# Altium project SDP21_Main_Board_REV1.PrjPcb
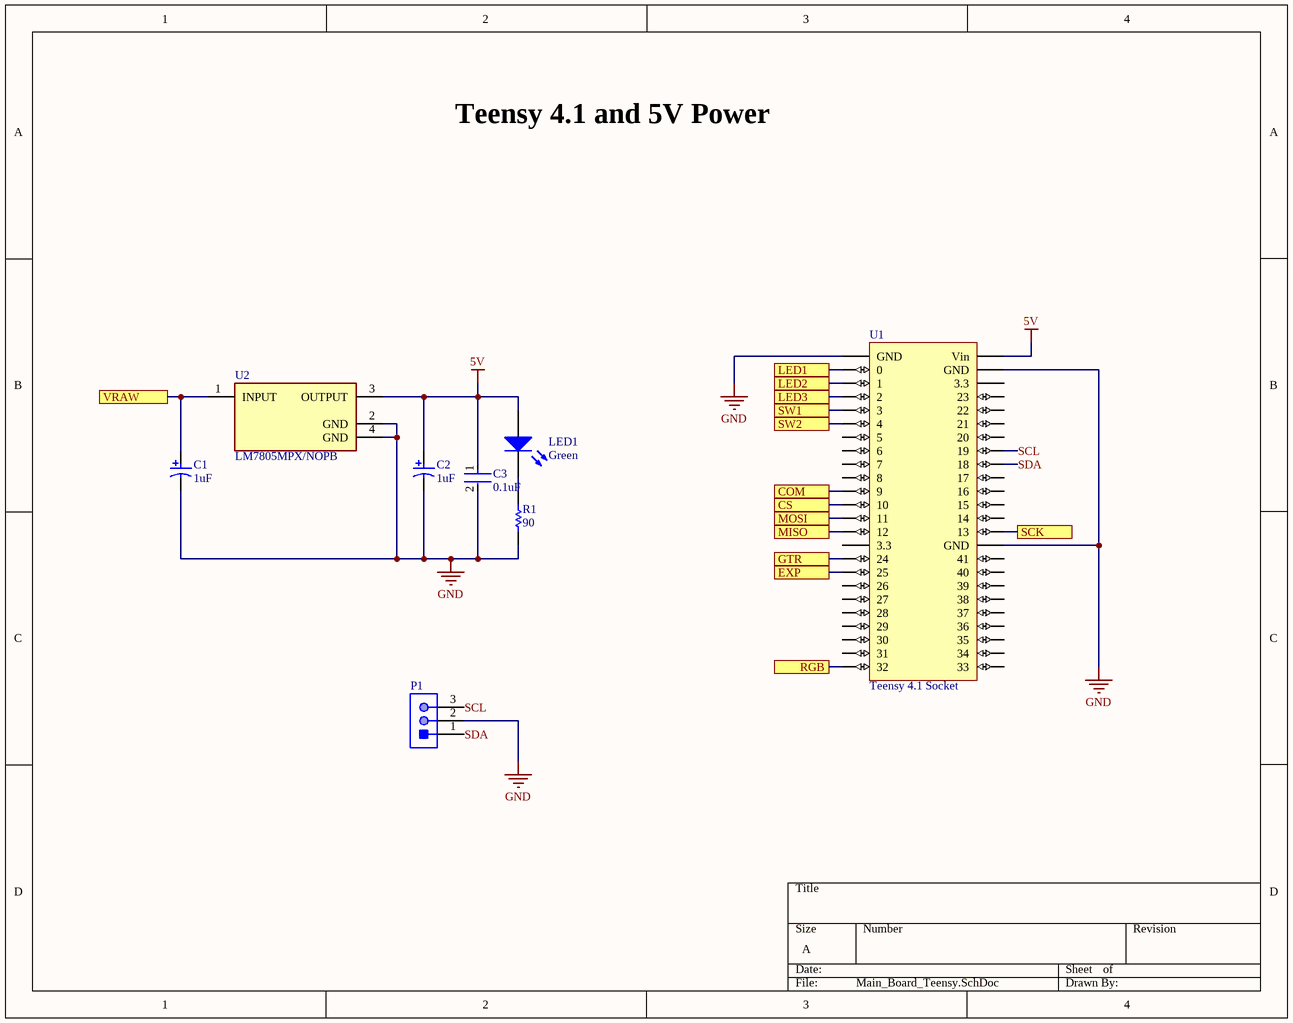
[diagram p0: Main_Board_Teensy.SchDoc]
4 sheets, 65 parts. Net scope: flat (ports and power ports of the same name join across sheets).
Board file: Main_Board_PCB.PcbDoc
Sheets:
  Main_Board_Teensy.SchDoc
  Main_Board_IO.SchDoc
  Main_Board_ESP32.SchDoc
  Main_Board_Guitar_Buffer.SchDoc

## Sheet Main_Board_Teensy.SchDoc
size A; SheetNumber: 1; SheetTotal: 4

### Parts
C1  1uF  [KEMT-T491-C_L]
C2  1uF  [KEMT-T491-C_L]
C3  0.1uF  [FP-GCM188-0_1-IPC_B]
LED1  Green  [0603_A]
P1  B3B-PH-K-S(LF)(SN)  [JST-B3B-PH-K-S-3_V]  (value not drawn)
R1  90  [RESC2013X50X40LL20T20]
U1  Teensy 4.1 Socket  [Teensy 4.1 Socket]
U2  LM7805MPX/NOPB  [FP-LM7805MPX-NOPB-MFG]

### Ports
COM, CS, EXP, GTR, LED1, LED2, LED3, MISO, MOSI, RGB, SCK, SW1, SW2, VRAW

### Nets
5V: C2.1 C3.1 LED1.2(A) U1.Vin U2.3(OUTPUT)
GND: C1.2 C2.2 C3.2 P1.2 R1.1 U1.GND1(GND) U1.GND2(GND) U1.GND3(GND) U2.2(GND) U2.4(GND)
SCL: P1.3 U1.19
SDA: P1.1 U1.18
NetC1_1: C1.1 U2.1(INPUT) ; port VRAW
NetC13_2: U1.24 ; port GTR
NetDS1_1: U1.0 ; port LED1
NetDS2_1: U1.1 ; port LED2
NetDS3_1: U1.2 ; port LED3
NetEXP1_2: U1.25 ; port EXP
NetLED1_1: LED1.1(K) R1.2
NetR7_1: U1.4 ; port SW2
NetR8_1: U1.3 ; port SW1
NetU1_9: U1.9 ; port COM
NetU1_10: U1.10 ; port CS
NetU1_11: U1.11 ; port MOSI
NetU1_12: U1.12 ; port MISO
NetU1_13: U1.13 ; port SCK
NetU1_32: U1.32 ; port RGB

Not connected (* = marked no-connect by the designer): U1 3.3-1(3.3) 3.3-2(3.3) 5 6 7 8 14 15 16 17 20 21 22 23 26 27 28 29 30 31 33 34 35 36 37 38 39 40 41

### Notes on the sheet
- Teensy 4.1 and 5V Power

### Library data of the parts
C1 C2 = CMP-2000-07195-1: Tantalum Capacitor, 1 uF, +/- 10%, 50 V, -55 to 125 degC, 2-Pin SMD, RoHS, Tape and Reel; Manufacturer: Kemet; Capacitance: 1000000pF; Rad Hardened: No; Case Style: Molded; Product Diameter (mm): NotRequiredmm; Seal: NotRequired; DF: 4%; ESR: 5.5ohm; DCL: 0.5uA; Product Length (mm): 6mm; Product Height (mm): 2.5mm; Polarity: Polar; Voltage: 50VDC; Product Depth (mm): 3.2mm; Operating Temp Range: -55Cto125C; Package Description: 2-Pin Surface Mount Device, Body 6 x 3.2 mm; Failure Rate: NotRequired; Seated Plane Height: NotRequiredmm; Lead Spacing (nom): NotRequiredmm; Packaging: TapeandReel; Case Code: C; Length W/Weld: NotRequiredmm; Tolerance (+ or -): 10%; Datasheet URL: http://capacitoredge.kemet.com/capedge2/DataSheet/Datasheet-T491C105K050AT.pdf?pn=T491C105K050AT; Datasheet Version: 10/2016; Manufacturer URL: http://www.kemet.com/; Wire Form: NotRequired; Package / Case: 6032-28; Mounting Technology: SurfaceMount; Construction: SMTChip; Package Reference: T491-C; Length W/Weld (max): NotRequiredmm; Insulation: NotRequired; Mounting Style: SurfaceMount
C3 = CMP-2006-02353-3: Ceramic Capacitor for Automotive 100nF  ±10% 50VDC X8L 0603 Paper T/R; Voltage Rating: 50V; Height: 0.8mm; Lead Free: Lead Free; Case/Package: 0603; Dielectric: X8L; Packaging: Tape and Reel; Termination: SMD/SMT; Package Quantity: 4000; Width: 0.5mm; Max Operating Temperature: 150°C; Case Code (Metric): 1608; Thickness: 0.035inch; Capacitance: 100nF; Tolerance: 10%; Voltage Rating (DC): 50V; Ratings: AEC-Q200; Case Code (Imperial): 0603; Voltage: 50V; Depth: 0.8mm; Radiation Hardening: No; Length: 1.6mm; Mount: Surface Mount; Min Operating Temperature: -55°C
LED1 = CMP-1426-00002-1: SMD mono-color Chip LED, WL-SMCW, Green; PartNumber: 150060GS75000; Manufacturer: Wuerth Elektronik; ComponentLink1URL: http://www.we-online.com; ComponentLink2Description: Datasheet; Color: Green; ComponentLink2URL: http://katalog.we-online.com/led/datasheet/150060GS75000.pdf; PackageReference: 0603_A; ComponentLink1Description: Manufacturer URL
P1 = CMP-2000-05164-1: Male Header, Pitch 2 mm, 1 x 3 Position, Height 6 mm, Tail Length 3.4 mm, -25 to 85 degC, RoHS, Bulk; Manufacturer: JST; Style/Orientation: StraightHeader/Plug; Pitch: 2mm; No of Positions: 3; Termination: Crimp; Manufacturer URL: http://www.jst.com/home2.html; Datasheet Version: Oct-06; Type: ShroudedHeader; Datasheet URL: https://datasheet.ciiva.com/11746/0900766b80826550-11746939.pdf
R1 = CMP-2001-03378-1: Manufacturer: Susumu; Part Number: RR1220P-331-D
U1 = Teensy 4.1 Socket: Teensy 4.1
U2 = CMP-04917-000022-1: IC REG LINEAR 5V 1.5A SOT223-4; Manufacturer: Texas Instruments; Dropout Voltage: 2V; Output Type: Fixed; Accuracy Percentage: 3%; Nominal Supply Current: 8mA; Standoff Height: 0.02mm; Min Supply Voltage: 7.5V; Number Of Outputs: 1; Max Junction Temp: +150°C; Max Supply Voltage: 30V; Height: 1.8mm; Temperature Range High: +125°C; Device Class L3: Voltage Regulators - Linear; Lead Free: Yes; Digikey Description: IC REG LINEAR 5V 1.5A SOT223-4; Output Current: 1.5A; Manufacturer Part Number: LM7805MPX/NOPB; Automotive: No; Device Class L1: Integrated Circuits (ICs); ComponentLink2Description: Datasheet; Device Class L2: Power Management ICs; Category: IC; Octopart: https://octopart.com/lm7805mpx%2Fnopb-texas+instruments-74629992; Package: SOT223-4; RoHS: TRUE; Output Voltage: 5V; Temperature Range Low: 0°C; Temperature: 0°C to +125°C; ComponentLink2URL: http://www.ti.com/lit/ds/symlink/lm7800.pdf

## Sheet Main_Board_IO.SchDoc
size Letter; SheetNumber: 2; SheetTotal: 4
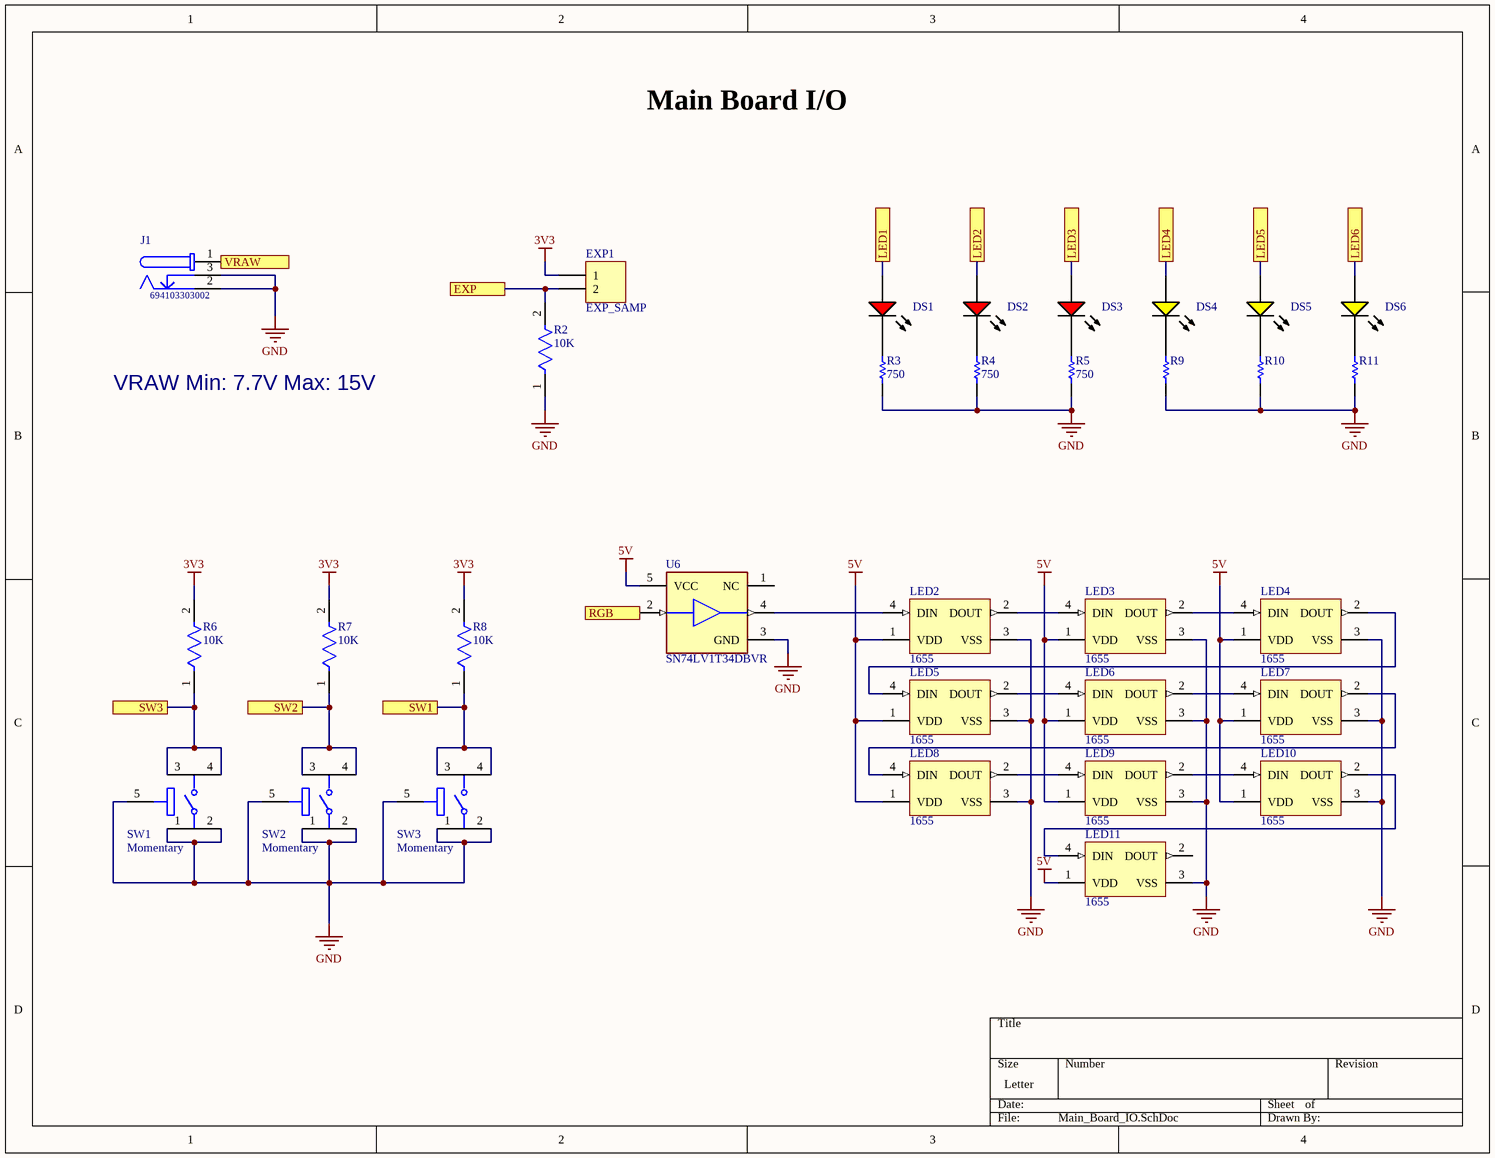
[diagram p1: Main_Board_IO.SchDoc]

### Parts
DS1  TLMS1000-GS08  [VISH-TLMS1000_V]  (value not drawn)
DS2  TLMS1000-GS08  [VISH-TLMS1000_V]  (value not drawn)
DS3  TLMS1000-GS08  [VISH-TLMS1000_V]  (value not drawn)
DS4  TLMY1000-GS08  [VISH-TLMY1000_V]  (value not drawn)
DS5  TLMY1000-GS08  [VISH-TLMY1000_V]  (value not drawn)
DS6  TLMY1000-GS08  [VISH-TLMY1000_V]  (value not drawn)
EXP1  EXP_SAMP  [HDR1X2]
J1  694103303002  [694103303002]
LED2  1655  [ADA-RGB-1655_V]
LED3  1655  [ADA-RGB-1655_V]
LED4  1655  [ADA-RGB-1655_V]
LED5  1655  [ADA-RGB-1655_V]
LED6  1655  [ADA-RGB-1655_V]
LED7  1655  [ADA-RGB-1655_V]
LED8  1655  [ADA-RGB-1655_V]
LED9  1655  [ADA-RGB-1655_V]
LED10  1655  [ADA-RGB-1655_V]
LED11  1655  [ADA-RGB-1655_V]
R2  10K  [FP-CR1206-IPC_B]
R3  750  [RESC2013X50X40LL20T20]
R4  750  [RESC2013X50X40LL20T20]
R5  750  [RESC2013X50X40LL20T20]
R6  10K  [FP-CR1206-IPC_B]
R7  10K  [FP-CR1206-IPC_B]
R8  10K  [FP-CR1206-IPC_B]
R9  RR1220P-331-D  [RESC2013X50X40LL20T20]  (value not drawn)
R10  RR1220P-331-D  [RESC2013X50X40LL20T20]  (value not drawn)
R11  RR1220P-331-D  [RESC2013X50X40LL20T20]  (value not drawn)
SW1  Momentary  [FP-B3SN-3112P-MFG]
SW2  Momentary  [FP-B3SN-3112P-MFG]
SW3  Momentary  [FP-B3SN-3112P-MFG]
U6  SN74LV1T34DBVR  [FP-DBV0005A-IPC_B]

### Ports
EXP, LED1, LED2, LED3, LED4, LED5, LED6, RGB, SW1, SW2, SW3, VRAW

### Nets
3V3: EXP1.1 R6.2 R7.2 R8.2
5V: LED2.1(VDD) LED3.1(VDD) LED4.1(VDD) LED5.1(VDD) LED6.1(VDD) LED7.1(VDD) LED8.1(VDD) LED9.1(VDD) LED10.1(VDD) LED11.1(VDD) U6.5(VCC)
GND: J1.2 J1.3 LED2.3(VSS) LED3.3(VSS) LED4.3(VSS) LED5.3(VSS) LED6.3(VSS) LED7.3(VSS) LED8.3(VSS) LED9.3(VSS) LED10.3(VSS) LED11.3(VSS) R2.1 R3.1 R4.1 R5.1 R9.1 R10.1 R11.1 SW1.1 SW1.2 SW1.5 SW2.1 SW2.2 SW2.5 SW3.1 SW3.2 SW3.5 U6.3(GND)
NetC1_1: J1.1 ; port VRAW
NetDS1_1: DS1.1(A) ; port LED1
NetDS1_2: DS1.2(K) R3.2
NetDS2_1: DS2.1(A) ; port LED2
NetDS2_2: DS2.2(K) R4.2
NetDS3_1: DS3.1(A) ; port LED3
NetDS3_2: DS3.2(K) R5.2
NetDS4_1: DS4.1(A) ; port LED4
NetDS4_2: DS4.2(K) R9.2
NetDS5_1: DS5.1(A) ; port LED5
NetDS5_2: DS5.2(K) R10.2
NetDS6_1: DS6.1(A) ; port LED6
NetDS6_2: DS6.2(K) R11.2
NetEXP1_2: EXP1.2 R2.2 ; port EXP
NetLED2_2: LED2.2(DOUT) LED3.4(DIN)
NetLED2_4: LED2.4(DIN) U6.4(Y)
NetLED3_2: LED3.2(DOUT) LED4.4(DIN)
NetLED4_2: LED4.2(DOUT) LED5.4(DIN)
NetLED5_2: LED5.2(DOUT) LED6.4(DIN)
NetLED6_2: LED6.2(DOUT) LED7.4(DIN)
NetLED7_2: LED7.2(DOUT) LED8.4(DIN)
NetLED8_2: LED8.2(DOUT) LED9.4(DIN)
NetLED9_2: LED9.2(DOUT) LED10.4(DIN)
NetLED10_2: LED10.2(DOUT) LED11.4(DIN)
NetR6_1: R6.1 SW1.3 SW1.4 ; port SW3
NetR7_1: R7.1 SW2.3 SW2.4 ; port SW2
NetR8_1: R8.1 SW3.3 SW3.4 ; port SW1
NetU1_32: U6.2(A) ; port RGB

Not connected (* = marked no-connect by the designer): LED11 2(DOUT); U6 1(NC)

### Notes on the sheet
- Main Board I/O
- VRAW Min: 7.7V Max: 15V

### Library data of the parts
DS1-DS3 = CMP-2000-07254-1: Low Current LED, 40 mW, 1.8 V, -40 to 100 degC, 2-Pin SMD (0603), RoHS, Tape and Reel; Manufacturer: Vishay; Lens Shape: Rectangular; Automotive Qualification Standard: AEC-Q100; Wavelength Typ: 636nm; SVHC: ToBeAdvised; LED Colour: Red; Bulb Size: 1.6mmx0.8mm; Forward Voltage: 1.8V; Luminous Intensity: 4mcd; Forward Current If: 2mA; Viewing Angle: 80°; Datasheet Version: Rev. 1.7, 02/2011; Datasheet URL: https://datasheet.ciiva.com/5798/1698881-5798337.pdf; LED Mounting: SMD; Packaging: CutTape; Package Reference: TLMS1000; Manufacturer URL: http://www.vishay.com/; Mounting Technology: SurfaceMount; Product Range: -; Package Description: 2-Pin Surface Mount Device, Body 1.6 x 0.8 mm; MSL: MSL2-1year
DS4-DS6 = CMP-2000-07255-1: Low Current LED, 40 mW, -40 to 100 degC, 2-Pin SMD, RoHS, Tape and Reel; Manufacturer: Vishay; Wavelength Typ: 595nm; Forward Current If: 2mA; Viewing Angle: 80°; Bulb Size: 1.6mmx0.8mm; Forward Voltage: 1.8V; Luminous Intensity: 7.5mcd; SVHC: ToBeAdvised; Automotive Qualification Standard: AEC-Q100; LED Colour: Yellow; Lens Shape: Rectangular; LED Mounting: SMD; Mounting Technology: SurfaceMount; Packaging: CutTape; MSL: MSL2-1year; Datasheet URL: http://www.vishay.com/docs/83172/tlmo1000.pdf; Package Reference: TLMY1000; Manufacturer URL: http://www.vishay.com/; Package Description: 2-Pin Surface Mount Device, Body 1.6 x 0.8 mm; Datasheet Version: Rev. 2.0, 09/2013; Product Range: -
EXP1 = Header 2: Header, 2-Pin; LatestRevisionDate: 17-Jul-2002; LatestRevisionNote: Re-released for DXP Platform.; Publisher: Altium Limited
J1 = CMP-1502-00185-1: DC Power Jack Connector WR-DC, Male, Right Angled, THT, 2 A, 30 V; Manufacturer: Wurth Elektronik; Plug Inner Diameter: 1.35mm; Working Voltage: 30V; Plug Outer Diameter: 3.5mm; Rated Current: 2A; Opening Diameter: 4.2mm; Operating Temperature: -40to85degC; Package Reference: 694103303002; Manufacturer URL: http://www.we-online.de; Part Number: 694103303002; Datasheet URL: http://katalog.we-online.de/em/datasheet/6941xx303002.pdf; Gender: Male; Mounting Technology: THT; Packaging: Bag; Publisher: WurthElektronik; Orientation: RightAngled
LED2-LED11 = CMP-2000-05026-1: Intelligent Control LED Integrated Light Source, 3.5 to 5.3 V, -25 to 80 degC, 4-Pin SMD, RoHS, Tape and Reel; Manufacturer: Adafruit-Industries-LLC; Number of LEDs: 10; Configuration: Discrete; Utilized LED: WS2812(5050); Color: Red,Green,Blue(RGB); Datasheet URL: http://datasheet.octopart.com/ADA1655-Adafruit-Industries-datasheet-32028139.pdf; Series: Neopixel; Interface: -; Package Description: 4-Pin Surface Mount Device, Body 5 x 5 mm; Category: Optoelectronics; Controller Type: -; Package Reference: 1655; Manufacturer URL: https://www.adafruit.com/; Mounting Type: SurfaceMount; Datasheet Version: May-13; Size / Dimension: 5.00mmLx5.00mmW; Family: Addressable,Specialty
R2 R6-R8 = CMP-07231-005593-1: Thick Film Chip Resistors 1206 10kΩ 0.25W 5% 200ppm/°C; Voltage Rating: 200V; Resistance: 10kR; Max Power Dissipation: 250mW; Temperature Coefficient: 200ppm/°C; Height: 0.6mm; Case Code (Imperial): 1206; REACH SVHC: No SVHC; Depth: 1.6mm; Mount: Surface Mount; Termination: SMD/SMT; Case/Package: 1206; Min Operating Temperature: -55°C; Features: Moisture Resistant; Number of Pins: 2; Length: 3.2mm; Military Standard: Not; Radiation Hardening: No; Max Operating Temperature: 155°C; Power Rating: 250mW; Case Code (Metric): 3216; Package Quantity: 1; Composition: Thick Film; Tolerance: 5%; Voltage Rating (DC): 200V; Contact Plating: Tin; Thickness: 610um; Number of Terminations: 2; Packaging: Tape and Reel; Width: 1.6mm
R3-R5 = CMP-2001-03378-1: as R1 on sheet Main_Board_Teensy
R9-R11 = CMP-2001-03378-1: Manufacturer: Susumu; Part Number: RR1220P-331-D
SW1-SW3 = CMP-08834-000011-1: SWITCH TACTILE SPST-NO 0.05A 24V; Contact Resistance: 100mR; Switch Function: Off-Mom; Actuator Type: Standard; Mechanical Life: 50000Cycles; Illumination Type: Non-Illuminated; Contact Current Rating: 50mA; Switch Travel: 0.25mm; Ratings: IP67; Throw Configuration: SPST; Number of Poles: 1; Operating Force: 1.57N; Length: 6.5mm; Contact Plating: Silver; Weight: 0.007055oz; Mount: Surface Mount; Min Operating Temperature: -20°C; Package Quantity: 1; Depth: 7mm; Case/Package: SMD/SMT; Packaging: Tape and Reel; Electrical Life: 50000Cycles; Radiation Hardening: No; Max Current Rating: 50mA; Voltage Rating (DC): 24V; Termination: SMD/SMT; Max Operating Temperature: 70°C; Orientation: Straight; Contact Material: Gold; Current Rating: 50mA; Max Voltage Rating (DC): 24V; Lead Free: Lead Free
U6 = CMP-0859-00123-4: IC BUF NON-INVERT 5.5V SOT23-5; Low Level Output Current: 8mA; Polarity: Non-Inverting; Number of Channels: 1; Propagation Delay: 15.5ns; High Level Output Current: -8mA; Quiescent Current: 1uA; Logic Function: Buffer; Min Supply Voltage: 1.6V; Min Operating Temperature: -40°C; Package Quantity: 3000; Max Operating Temperature: 125°C; Operating Supply Current: 8mA; Radiation Hardening: No; REACH SVHC: No SVHC; Number of Bits per Element: 1; Mount: Surface Mount; Number of Outputs: 1; Lead Free: Lead Free; Number of Pins: 5; Weight: 0.000353oz; Number of Output Lines: 1; Number of Elements: 1; Number of Input Lines: 1; Number of Bits: 1; Case/Package: SOT-23-5; Packaging: Tape and Reel; Max Supply Voltage: 5.5V; Number of Inputs: 1

## Sheet Main_Board_ESP32.SchDoc
size A; SheetNumber: 3; SheetTotal: 4
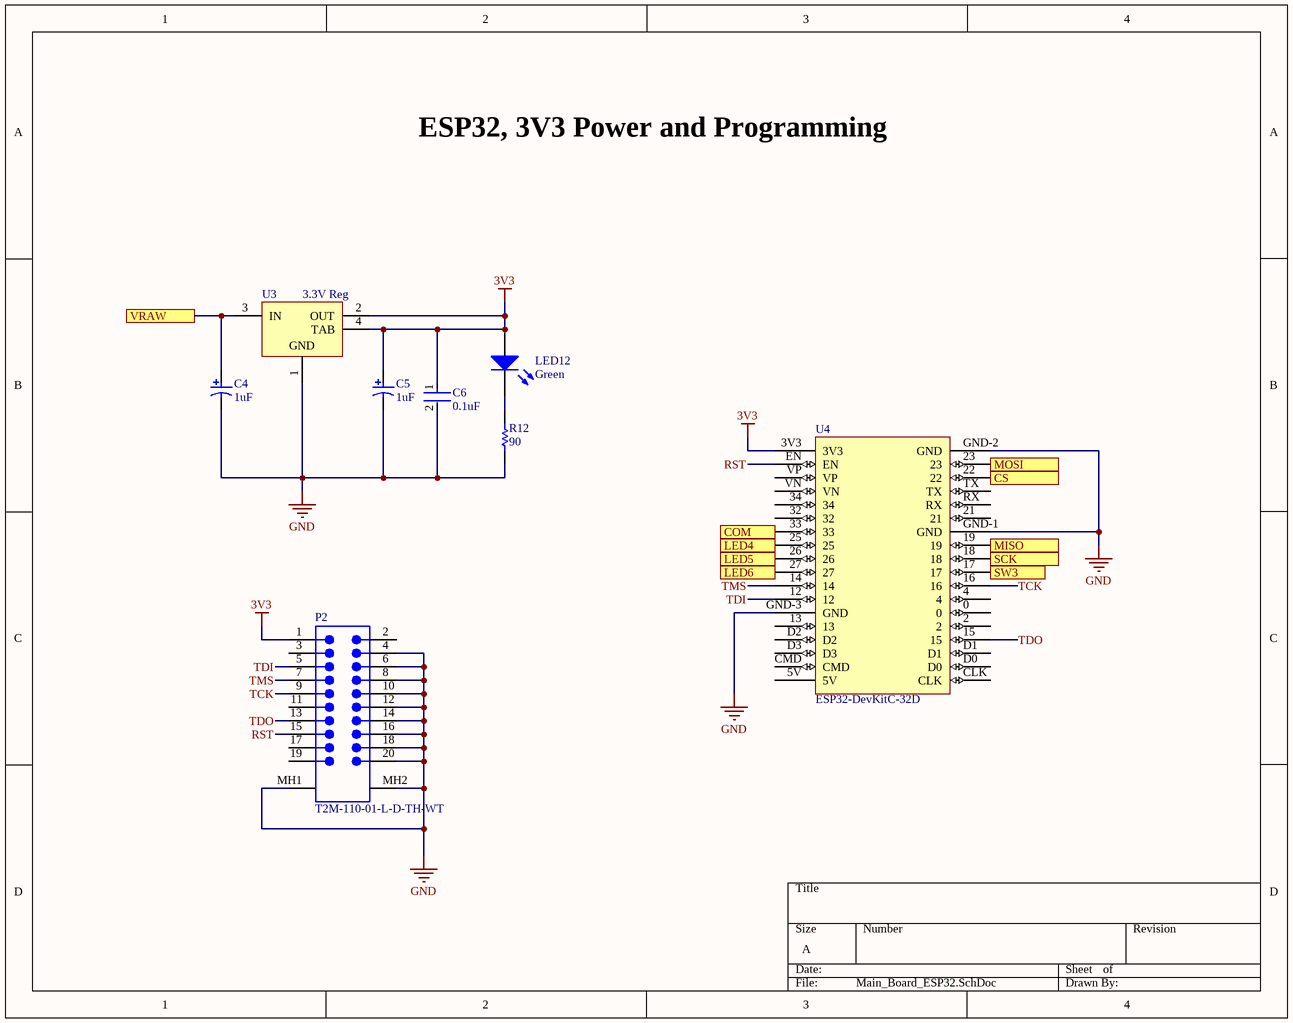
[diagram p2: Main_Board_ESP32.SchDoc]

### Parts
C4  1uF  [KEMT-T491-C_L]
C5  1uF  [KEMT-T491-C_L]
C6  0.1uF  [FP-GCM188-0_1-IPC_B]
LED12  Green  [0603_A]
P2  T2M-110-01-L-D-TH-WT  [SMTC-T2M-110-01-X-D-TH-WT]
R12  90  [RESC2013X50X40LL20T20]
U3  3.3V Reg  [KTT0003B_N]
U4  ESP32-DevKitC-32D  [ESP32-DevKitC-32D]

### Ports
COM, CS, LED4, LED5, LED6, MISO, MOSI, SCK, SW3, VRAW

### Nets
3V3: C5.1 C6.1 LED12.2(A) P2.1 U3.2(OUT) U3.4(TAB) U4.3V3
GND: C4.2 C5.2 C6.2 P2.4 P2.6 P2.8 P2.10 P2.12 P2.14 P2.16 P2.18 P2.20 P2.MH1 P2.MH2 R12.1 U3.1(GND) U4.GND-1(GND) U4.GND-2(GND) U4.GND-3(GND)
RST: P2.15 U4.EN
TCK: P2.9 U4.16
TDI: P2.5 U4.12
TDO: P2.13 U4.15
TMS: P2.7 U4.14
NetC1_1: C4.1 U3.3(IN) ; port VRAW
NetDS4_1: U4.25 ; port LED4
NetDS5_1: U4.26 ; port LED5
NetDS6_1: U4.27 ; port LED6
NetLED12_1: LED12.1(K) R12.2
NetR6_1: U4.17 ; port SW3
NetU1_9: U4.33 ; port COM
NetU1_10: U4.22 ; port CS
NetU1_11: U4.23 ; port MOSI
NetU1_12: U4.19 ; port MISO
NetU1_13: U4.18 ; port SCK

Not connected (* = marked no-connect by the designer): P2 2 3 11 17 19; U4 0 2 4 5V 13 21 32 34 CLK CMD D0 D1 D2 D3 RX TX VN VP

### Notes on the sheet
- ESP32, 3V3 Power and Programming

### Library data of the parts
C4 C5 = CMP-2000-07195-1: as C1 on sheet Main_Board_Teensy; Operating Temp Range: -55Cto125C; Package Description: 2-Pin Surface Mount Device, Body 6 x 3.2 mm; Failure Rate: NotRequired; Seated Plane Height: NotRequiredmm; Lead Spacing (nom): NotRequiredmm; Packaging: TapeandReel; Case Code: C; Length W/Weld: NotRequiredmm; Tolerance (+ or -): 10%; Datasheet URL: http://capacitoredge.kemet.com/capedge2/DataSheet/Datasheet-T491C105K050AT.pdf?pn=T491C105K050AT; Datasheet Version: 10/2016; Manufacturer URL: http://www.kemet.com/; Wire Form: NotRequired; Package / Case: 6032-28; Mounting Technology: SurfaceMount; Construction: SMTChip; Package Reference: T491-C; Length W/Weld (max): NotRequiredmm; Insulation: NotRequired; Mounting Style: SurfaceMount
C6 = CMP-2006-02353-3: as C3 on sheet Main_Board_Teensy; Height: 0.8mm; Lead Free: Lead Free; Case/Package: 0603; Dielectric: X8L; Packaging: Tape and Reel; Termination: SMD/SMT; Package Quantity: 4000; Width: 0.5mm; Max Operating Temperature: 150°C; Case Code (Metric): 1608; Thickness: 0.035inch; Capacitance: 100nF; Tolerance: 10%; Voltage Rating (DC): 50V; Ratings: AEC-Q200; Case Code (Imperial): 0603; Voltage: 50V; Depth: 0.8mm; Radiation Hardening: No; Length: 1.6mm; Mount: Surface Mount; Min Operating Temperature: -55°C
LED12 = CMP-1426-00002-1: as LED1 on sheet Main_Board_Teensy; ComponentLink1URL: http://www.we-online.com; ComponentLink2Description: Datasheet; Color: Green; ComponentLink2URL: http://katalog.we-online.com/led/datasheet/150060GS75000.pdf; PackageReference: 0603_A; ComponentLink1Description: Manufacturer URL
P2 = CMP-1029-00094-1: High Reliability Cable Header, Through-hole, Vertical, -55 to 125 degC, 2 mm Pitch, 20-Pin, Male, RoHS; Manufacturer: Samtec; Pitch: 2 mm; ComponentLink3URL: http://www.samtec.com/documents/webfiles/cpdf/T2M-1XX-XX-X-D-XX-XX-MKT.pdf; Mounting Technology: Through-hole; Orientation: Vertical; ComponentLink2URL: http://d2a072wq521u33.cloudfront.net/catalog_english//t2m.pdf; ComponentLink1URL: http://www.samtec.com; ComponentLink2Description: Datasheet; PackageReference: T2M-110-01-X-D-TH-WT; ComponentLink1Description: Manufacturer URL; RoHS: True; ComponentLink3Description: Package Specification; PartNumber: T2M-110-01-L-D-TH-WT; PackageDescription: 2mm Shrouded Terminal Strip; PackageVersion: V, 3/2009; Temperature Range: -55 to 125 degC; DatasheetVersion: F-214
R12 = CMP-2001-03378-1: as R1 on sheet Main_Board_Teensy
U3 = CMP-0062-00678-5: 800mA Low-Dropout Linear Regulator, 3-pin TO-263, Pb-Free; PartNumber: LM1117SX-3.3/NOPB; Manufacturer: Texas Instruments; CompType: LDO IC; PowerWise: N; PackageTopMarking: NSUZXYTTE#*LM1117S*3.3; High-Reliability: Y; RoHS: Y; ComponentLink1URL: http://www.ti.com/general/docs/lit/getliterature.tsp?genericPartNumber=LM1117&fileType=pdf; PackageDescription: TO-263, Molded, .400 x .390 x .180in, 3 Lead, .1in Pitch, Surface Mount; PackageReference: KTT0003B; Code_JEDEC: MO-169-AA; PinCount: 3; ComponentLink1Description: Datasheet URL

## Sheet Main_Board_Guitar_Buffer.SchDoc
size A; SheetNumber: 4; SheetTotal: 4
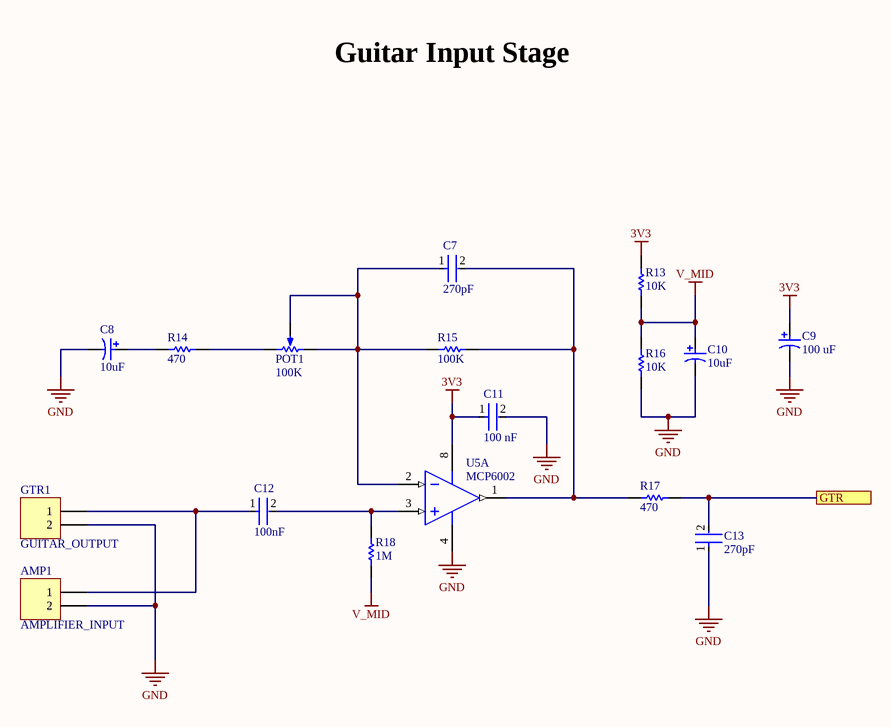
[diagram p3: Main_Board_Guitar_Buffer.SchDoc]

### Parts
AMP1  AMPLIFIER_INPUT  [HDR1X2]
C7  270pF  [FP-C0805C-DN-MFG]
C8  10uF  [KEMT-A-3216-18-2_M]
C9  100 uF  [KEMT-T491-D_L]
C10  10uF  [KEMT-A-3216-18-2_M]
C11  100 nF  [FP-C0805C-DN-MFG]
C12  100nF  [FP-C0805C-DN-MFG]
C13  270pF  [FP-C0805C-DN-MFG]
GTR1  GUITAR_OUTPUT  [HDR1X2]
POT1  100K  [BOUR-3362P]
R13  10K  [RESC2013X60X35NL10T20]
R14  470  [RESC2013X70X40ML20T20]
R15  100K  [RESC2013X60X35ML10T20]
R16  10K  [RESC2013X60X35NL10T20]
R17  470  [RESC2013X70X40ML20T20]
R18  1M  [RESC2013X70X40NL20T20]
U5  MCP6002  [SOIC-SN8_M]  (part A of 2)

### Ports
GTR

### Nets
3V3: C9.1 C11.1 R13.2 U5.8(VDD)
GND: AMP1.2 C8.2 C9.2 C10.2 C11.2 C13.1 GTR1.2 R16.1 U5.4(VSS)
V_MID: C10.1 R13.1 R16.2 R18.1
NetAMP1_1: AMP1.1 C12.1 GTR1.1
NetC7_1: C7.1 POT1.1(CCW) POT1.2(S) R15.1 U5.2(VINA-)
NetC7_2: C7.2 R15.2 R17.1 U5.1(VOUTA)
NetC8_1: C8.1 R14.1
NetC12_2: C12.2 R18.2 U5.3(VINA+)
NetC13_2: C13.2 R17.2 ; port GTR
NetPOT1_3: POT1.3(CW) R14.2

### Notes on the sheet
- Guitar Input Stage

### Library data of the parts
AMP1 GTR1 = Header 2: Header, 2-Pin; LatestRevisionDate: 17-Jul-2002; LatestRevisionNote: Re-released for DXP Platform.; Publisher: Altium Limited
C7 C13 = CMP-1036-02406-3: CAP CER 270PF 50V C0G/NP0 0805; Manufacturer: KEMET; Manufacturer Part Number: C0805C271J5GACTU; Material: Ceramic; Temperature Characteristic: C0G; Temperature Coefficient: 30ppm/°C; Tolerance: 0.05; Device Class L3: Ceramic Capacitors; Lead Free: Yes; Ipc Land Pattern Name: CAPC200125X78; Digikey Description: CAP CER 270PF 50V C0G/NP0 0805; Device Class L1: Passive Components; Temperature: -55°C to +125°C; ComponentLink2Description: Datasheet; Voltage Rating: 50 V; Temperature Range High: +125°C; Height: 0.88mm; Capacitance: 270 pF; Mouser Description: Multilayer Ceramic Capacitors MLCC - SMD/SMT 50volts 270pF C0G 5%; Value: 270 pF; ComponentLink2URL: https://content.kemet.com/datasheets/KEM_C1003_C0G_SMD.pdf; RoHS: TRUE; Temperature Range Low: -55°C; Device Class L2: Capacitors; Automotive: No; Octopart: https://octopart.com/c0805c271j5gactu-kemet-104903; Category: Cap; Package: C0805C-DN
C8 C10 = CMP-2000-05172-1: Capacitor, Tantalum, 10 uF, +/- 10%, 10 V, -55 to 125 degC, 2-Pin SMD (1206), RoHS, Tape and Reel; Manufacturer Size Code: A; Manufacturer: Kemet; Type: Molded; Online Catalog: T491Series; Other Names: 399-3684-2; Voltage - Rated: 10V; Lifetime @ Temp.: 2000Hrs@85degC; Product Training Modules: CapacitorBasics-TypicalUsesforCapacitorsDeratingGuidelinesforSurfaceMountTantalumCapacitors; ESR (Equivalent Series Resistance): 3.8Ohm; Capacitance: 10µF; Catalog Drawings: T49x,T5xxSeries_A-side1T49x,T5xxSeries_A,B-side2T49x,T5xxSeries_A,SBottom; Family: TantalumCapacitors; Manufacturer URL: http://www.kemet.com/; Datasheet URL: http://www.farnell.com/datasheets/1824869.pdf; Package Reference: 1206; Packaging: Tape&Reel(TR); Series: T491; Operating Temperature: -55degC~125degC; Mounting Type: SurfaceMount; Height - Seated (Max): 0.071"(1.80mm); Package / Case: 1206(3216Metric); Package Description: 2-Pin Surface Mount Device, Body 3.2 x 1.6 mm; Features: GeneralPurpose; Tolerance: ±10%; Lead Spacing: -; Size / Dimension: 0.126"Lx0.063"W(3.20mmx1.60mm); Standard Package: 2,000; Datasheet Version: Apr-14; Category: Capacitors
C9 = CMP-2000-07541-1: Tantalum Surface Mount Capacitor, 100 uF, +/- 10%, 16 V, -55 to 125 degC, 2917 (7343 Metric), RoHS, Tape and Reel; Manufacturer: Kemet; ESR (Equivalent Series Resistance): 700mOhm; Dissipation Factor: 8%; Voltage Rating (DC): 16V; Case\/Package: Molded; Polarity: Polar; Capacitance: 100uF; Life (Hours): 2000Hour; Leakage Current: 16uA; Ripple Current: 463mA; RoHSCompliant: true; Datasheet Version: 07/2017; Case Code (Imperial): 2917; Width: 4.3mm; Height: 2.8mm; Min Operating Temperature: -55degC; Length: 7.3mm; Package Reference: T491-D; Dielectric Material: Tantalum; Packaging: TapeandReel; Max Operating Temperature: 125degC; Package Description: 2-Pin Surface Mount Device, Body 7.3 x 4.3 mm; Package Quantity: 1; Lead Free: LeadFree; Case Code (Metric): 7343; Voltage: 16V; Voltage Rating: 16V; Tolerance: 10%; Weight: 0.023634oz; Termination: SMD/SMT; Lead Pitch: 3.6mm; Manufacturer URL: http://www.kemet.com/; Datasheet URL: http://www.kemet.com/Lists/ProductCatalog/Attachments/254/KEM_T2005_T491.pdf; Radiation Hardening: No; Mount: PCB; Height - Seated (Max): 0.122inch; Mounting Technology: SurfaceMount; Depth: 4.3mm; REACH SVHC: NoSVHC
C11 C12 = CMP-2007-00279-2: CAP CER 0.1UF 50V X7R 0805; Manufacturer Part Number: C0805C104K5RACTU; Manufacturer: KEMET; Value: 0.10 μF; Tolerance: 0.1; Temperature Coefficient: 30ppm/°C; Material: Ceramic; Device Class L2: Capacitors; Temperature Range Low: -55°C; Voltage Rating: 50 V; Digikey Description: CAP CER 0.1UF 50V X7R 0805; Category: Cap; ComponentLink2Description: Datasheet; Octopart: https://octopart.com/c0805c104k5ractu-kemet-143926; RoHS: TRUE; ComponentLink2URL: https://content.kemet.com/datasheets/KEM_C1003_C0G_SMD.pdf; Temperature Characteristic: X7R; Temperature: -55°C to +125°C; Height: 0.88mm; Temperature Range High: +125°C; Device Class L1: Passive Components; Automotive: No; Lead Free: Yes; Ipc Land Pattern Name: CAPC200125X78; Device Class L3: Ceramic Capacitors; Mouser Description: Cap Ceramic 0.1uF 50V X7R 10% SMD 2.0 x 1.2 mm 125 C Paper T/R; Capacitance: 0.10 μF; Package: C0805C-DN
POT1 = CMP-1747-00003-1: Square Trimpot(R) Trimming Potentiometer, 100 KOhm, 300 V, -55 to 125 degC, 3-Pin THD, RoHS, Tube; Voltage Rating: 250 V; Case\Package: Axial; Tolerance: 1%; Power Rating: 250 mW; Resistance: 1 mohm; RoHSCompliant: true; ComponentLink2URL: http://www.bourns.com/docs/Product-Datasheets/3362.pdf; ComponentLink1Description: Manufacturer URL; DatasheetVersion: May-16; Package Quantity: 200; ComponentLink2Description: Datasheet; Min Operating Temperature: -55 degC; Mount: Through Hole; PackageDescription: 3-Pin Through Hole Device, Body 6.6 x 6.99 mm, Pitch 2.54 mm; Length: 0.248 inch; ComponentLink1URL: http://www.bourns.com/; PackageReference: 3326P; Max Operating Temperature: 155 degC; Packaging: Bulk
R13 R16 = CMP-1659-00013-4: Chip Resistor, 10 KOhm, +/- 1%, 0.125 W, -55 to 155 degC, 0805 (2012 Metric), RoHS, Tape and Reel; Manufacturer: Yageo; Voltage Rating: 150 V; Mount: Surface Mount; ComponentLink1Description: Manufacturer URL; ComponentLink2URL: http://www.yageo.com/documents/recent/PYu-RC_Group_51_RoHS_L_04.pdf; Pins: 2; Length: 2 mm; Min Operating Temperature: -55 degC; Height: 0.5 mm; Mounting Technology: Surface Mount; RoHSCompliant: true; REACH SVHC: No SVHC; ComponentLink1URL: http://www.yageo.com/; Max Operating Temperature: 155 degC; PackageReference: 0805; DatasheetVersion: Rev. 4, 02/2016; Package Quantity: 5000; Packaging: Tape and Reel; ComponentLink2Description: Datasheet; PackageDescription: 2-Pin Surface Mounted Device, Body 2 x 1.25 mm
R14 R17 = CMP-2001-00549-5: Chip Resistor, 470 Ohm, +/- 1%, 0.125 W, -55 to 155 degC, 0805 (2012 Metric), RoHS, Tape and Reel; Manufacturer: Panasonic; Voltage Rating: 150 V; ComponentLink1URL: http://www.panasonic.com/; ComponentLink2Description: Datasheet; RoHSCompliant: true; PackageDescription: 2-Pin Surface Mount Device, Body 2 x 1.25 mm; PackageReference: 0805; REACH SVHC: Yes; Max Operating Temperature: 155 degC; Mount: Surface Mount; Min Operating Temperature: -55 degC; DatasheetVersion: 04/2015; Mounting Technology: Surface Mount; Height: 0.6 mm; Package Quantity: 1; ComponentLink2URL: http://industrial.panasonic.com/cdbs/www-data/pdf/RDA0000/AOA0000C86.pdf; Length: 2 mm; ComponentLink1Description: Manufacturer URL; Pins: 2; Packaging: Cut Tape
R15 = CMP-2100-03668-1: Chip Resistor, 100 KOhm, +/- 1%, 0.125 W, -55 to 155 degC, 0805 (2012 Metric), RoHS, Tape and Reel; Manufacturer: Yageo; Max Power Dissipation: 125mW; Voltage Rating: 150V; Temperature Coefficient: 100ppm/degreesC; Manufacturer URL: http://www.yageo.com/; Min Operating Temperature: -55degC; Lead Pitch: 0.4mm; Composition: ThickFilm; Case Code (Metric): 2012; Military Standard: Not; Package Description: 2-Pin Surface Mounted Device, Body 2 x 1.25 mm; REACH SVHC: Unknown; RoHSCompliant: true; Depth: 1.25mm; Number of Pins: 2; Lead Free: LeadFree; Resistance: 100KOhm; Datasheet URL: http://www.yageo.com/NewPortal/yageodocoutput?fileName=/pdf/R-Chip/PYu-RC_Group_51_RoHS_L_5.pdf; Max Operating Temperature: 155degC; Case/Package: 0805; Package Quantity: 1; Case Code (Imperial): 0805; Power Rating: 125mW; Width: 0.049inch; Package Reference: 0805; Height: 0.024inch; Termination: SMD/SMT; Tolerance: 1%; Datasheet Version: Rev. 5, 10/2016; Length: 2mm; Voltage Rating (DC): 150V; Number of Terminations: 2; Packaging: TapeandReel
R18 = CMP-2001-04378-5: Chip Resistor, 1000 KOhm, +/- 1%, 0.125 W, -55 to 155 degC, 0805 (2012 Metric), RoHS, Tape and Reel; Manufacturer: Panasonic; Voltage Rating: 150 V; ComponentLink2URL: http://industrial.panasonic.com/cdbs/www-data/pdf/RDA0000/AOA0000C86.pdf; PackageReference: 0805; Min Operating Temperature: -55 degC; RoHSCompliant: true; Package Quantity: 5000; ComponentLink1URL: http://www.panasonic.com/; Pins: 2; Height: 0.6 mm; Packaging: Tape and Reel; ComponentLink2Description: Datasheet; ComponentLink1Description: Manufacturer URL; Mounting Technology: Surface Mount; REACH SVHC: Yes; Mount: Surface Mount; PackageDescription: 2-Pin Surface Mount Device, Body 2 x 1.25 mm; DatasheetVersion: 04/2015; Max Operating Temperature: 155 degC; Length: 2 mm
U5 = CMP-0187-00368-2: 1 MHz, Low-Power Operational Amplifier, 8-Pin SOIC, Extended Temperature; ComponentLink1URL: http://www.microchip.com/; ComponentLink2URL: http://ww1.microchip.com/downloads/en/DeviceDoc/21733j.pdf; ComponentLink3URL: http://www.microchip.com/stellent/groups/techpub_sg/documents/packagingspec/en012702.pdf; Code_JEDEC: MS-012; PackageVersion: revBB, Aug-2009; ComponentLink2Description: Datasheet; PackageDescription: 8-Lead Plastic Small Outline (SN) - Narrow, 3.90mm Body [SOIC]; PackageReference: SOIC-SN8; ComponentLink1Description: Manufacturer URL; RevisionNote: URLs added.; Code_IPC: SOIC127P600-8; ComponentLink3Description: Package Specification; DatasheetVersion: revJ, Nov-2009

## Nets that join several sheets
3V3: Main_Board_IO (EXP1.1 R6.2 R7.2 R8.2), Main_Board_ESP32 (7 pins), Main_Board_Guitar_Buffer (C9.1 C11.1 R13.2 U5.8)
5V: Main_Board_Teensy (5 pins), Main_Board_IO (11 pins)
GND: Main_Board_Teensy (10 pins), Main_Board_IO (29 pins), Main_Board_ESP32 (19 pins), Main_Board_Guitar_Buffer (9 pins)
NetC1_1: Main_Board_Teensy (C1.1 U2.1), Main_Board_IO (J1.1), Main_Board_ESP32 (C4.1 U3.3)
NetC13_2: Main_Board_Teensy (U1.24), Main_Board_Guitar_Buffer (C13.2 R17.2)
NetDS1_1: Main_Board_Teensy (U1.0), Main_Board_IO (DS1.1)
NetDS2_1: Main_Board_Teensy (U1.1), Main_Board_IO (DS2.1)
NetDS3_1: Main_Board_Teensy (U1.2), Main_Board_IO (DS3.1)
NetDS4_1: Main_Board_IO (DS4.1), Main_Board_ESP32 (U4.25)
NetDS5_1: Main_Board_IO (DS5.1), Main_Board_ESP32 (U4.26)
NetDS6_1: Main_Board_IO (DS6.1), Main_Board_ESP32 (U4.27)
NetEXP1_2: Main_Board_Teensy (U1.25), Main_Board_IO (EXP1.2 R2.2)
NetR6_1: Main_Board_IO (R6.1 SW1.3 SW1.4), Main_Board_ESP32 (U4.17)
NetR7_1: Main_Board_Teensy (U1.4), Main_Board_IO (R7.1 SW2.3 SW2.4)
NetR8_1: Main_Board_Teensy (U1.3), Main_Board_IO (R8.1 SW3.3 SW3.4)
NetU1_9: Main_Board_Teensy (U1.9), Main_Board_ESP32 (U4.33)
NetU1_10: Main_Board_Teensy (U1.10), Main_Board_ESP32 (U4.22)
NetU1_11: Main_Board_Teensy (U1.11), Main_Board_ESP32 (U4.23)
NetU1_12: Main_Board_Teensy (U1.12), Main_Board_ESP32 (U4.19)
NetU1_13: Main_Board_Teensy (U1.13), Main_Board_ESP32 (U4.18)
NetU1_32: Main_Board_Teensy (U1.32), Main_Board_IO (U6.2)